# Altium schematic sheet RS232_ttl.SchDoc
size A4; SheetNumber: 1; SheetTotal: 1
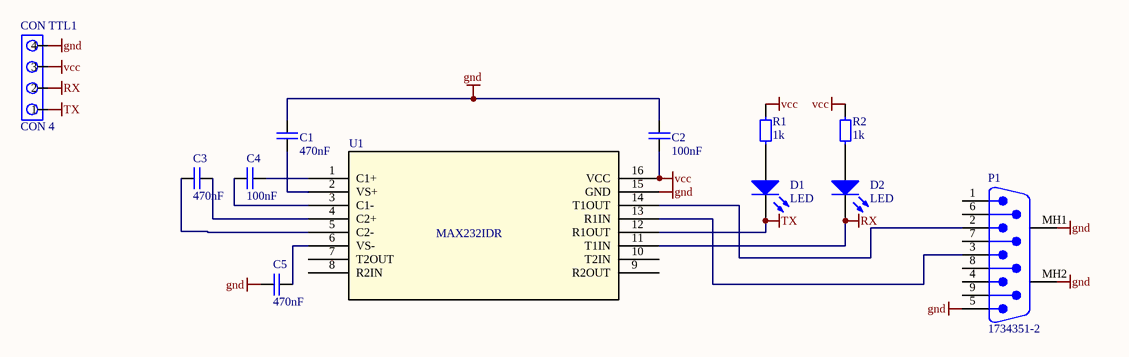
[diagram p0: RS232_ttl.SchDoc]

## Parts
C1  470nF  [1206-C]
C2  100nF  [1206-C]
C3  470nF  [1206-C]
C4  100nF  [1206-C]
C5  470nF  [1206-C]
CON_TTL1  CON 4  [CON-4 2.54]
D1  LED  [1206-D]
D2  LED  [1206-D]
P1  1734351-2  [1734351-2]
R1  1k  [1206-R]
R2  1k  [1206-R]
U1  MAX232IDR  [MAX232IDR]

## Nets
gnd: C1.2 C2.2 C5.1 CON_TTL1.4 P1.5 P1.MH1 P1.MH2 U1.15(GND)
RX: CON_TTL1.2 D2.2(K) U1.11(T1IN)
TX: CON_TTL1.1 D1.2(K) U1.12(R1OUT)
vcc: C2.1 CON_TTL1.3 R1.1 R2.1 U1.16(VCC)
NetC1_1: C1.1 U1.2(VS+)
NetC3_1: C3.1 U1.5(C2-)
NetC3_2: C3.2 U1.4(C2+)
NetC4_1: C4.1 U1.3(C1-)
NetC4_2: C4.2 U1.1(C1+)
NetC5_2: C5.2 U1.6(VS-)
NetD1_1: D1.1(A) R1.2
NetD2_1: D2.1(A) R2.2
NetP1_2: P1.2 U1.14(T1OUT)
NetP1_3: P1.3 U1.13(R1IN)

Not connected (* = marked no-connect by the designer): P1 1 4 6 7 8 9; U1 7(T2OUT) 8(R2IN) 9(R2OUT) 10(T2IN)

## Library data of the parts
C1-C5 = Cap: Capacitor; Published: 8-Jun-2000; LatestRevisionDate: 17-Jul-2002; LatestRevisionNote: Re-released for DXP Platform.; PackageReference: RAD-0.3; Publisher: Altium Limited; PackageDescription: Radial Cap, Thru-Hole; 2 Leads; 0.3 in Pin Spacing
D1 D2 = LED: Typical INFRARED GaAs LED; Published: 8-Jun-2000; LatestRevisionDate: 08-Jul-2005; LatestRevisionNote: Mech Layer 1 removed.; PackageReference: LED-0; Publisher: Altium Limited; PackageDescription: LED; 2 Leads
P1 = CN-2S-2M-D9: Male D-Sub Connector, Pitch 2.77 mm, 9 Position, Height 12.75 mm, Tail Length 3.2 mm, -55 to 105 degC, RoHS, Tray; Manufacturer: TE Connectivity; Featured Product: AMPLIMITED-SubminiatureConnectors; Mating Products: 5746861-4-ND / -CONNRECEPT9POSGOLDIDC / AFL09B-ND / -CONND-SUBRECEPT9POS30GOLD; Connector Type: Plug,MalePins; Number of Positions: 9; Catalog Drawings: AMPD-SubMale.318; Current Rating: 2A; Flange Feature: MatingSide;FemaleScrewlock(4-40); Voltage Rating: 250V; Product Training Modules: AMPLIMITED-SubConnectors; Dynamic Catalog: AMPLIMITEHD-20Series; Other Names: A35106; Standard Package: 90; Contact Finish Thickness: 15µin(0.38µm); Shell Size, Connector Layout: 1(DE,E); Features: BoardLock,GroundingIndents; Color: Black; Operating Temperature: -55°C~105°C; Manufacturer URL: http://www.te.com/; Package Reference: 1734351-2; Family: D-SubConnectors; Contact Type: Signal; Mounting Technology: ThroughHole; Series: AMPLIMITEHD-20; RoHS Information: 1734351-2StatementofCompliance; Datasheet Version: Rev. A1, 03/2011; Termination: Solder; Housing Material: PolybutyleneTerephthalate(PBT); Datasheet URL: https://datasheet.ciiva.com/25605/0900766b80f99384-25605515.pdf; Connector Style: D-Sub; Category: Connectors,Interconnects; Mounting Type: ThroughHole,RightAngle; Package Description: Male D-Sub Connector, Pitch 2.77 mm, 9 Position, Height 12.75 mm, Tail Length 3.2 mm; Contact Finish: Gold; Number of Rows: 2; Shell Material, Finish: Steel,NickelPlated
R1 R2 = Res_2
U1 = MAX232IDR: No Description Available; Mfr_Name: Texas Instruments; Copyright: Copyright (C) 2022 Ultra Librarian. All rights reserved.; Manufacturer_Part_Number: MAX232IDR; RefDes: RefDes; Type: DEV